# EAGLE design noiseometer_v1 (EAGLE 7.5.0)
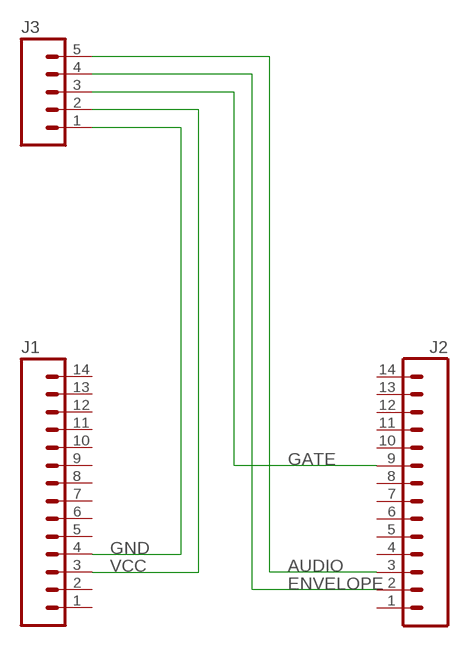
[diagram p0: schematic, sheet 1]

## Parts
J1  M14  [1X14]
J2  M14  [1X14]
J3  M05PTH  [1X05]

## Nets
AUDIO: J2.3 J3.5
ENVELOPE: J2.2 J3.4
GATE: J2.9 J3.3
GND: J1.4 J3.1
VCC: J1.3 J3.2
Unconnected: J1.1 J1.2 J1.5 J1.6 J1.7 J1.8 J1.9 J1.10 J1.11 J1.12 J1.13 J1.14 J2.1 J2.4 J2.5 J2.6 J2.7 J2.8 J2.10 J2.11 J2.12 J2.13 J2.14

## Library data of the parts
J1 J2 = SparkFun-Connectors:M14: Header 14 Standard 14-pin 0.1" header. Use with straight break away headers (SKU : PRT-00116), right angle break away headers (PRT-00553), swiss pins (PRT-00743), machine pins (PRT-00117), and female headers (PRT-00115).
J3 = SparkFun-Connectors:M05: Header 5 Standard 5-pin 0.1" header. Use with straight break away headers (SKU : PRT-00116), right angle break away headers (PRT-00553), swiss pins (PRT-00743), machine pins (PRT-00117), and female headers (PRT-00115). Molex polarized connector foot print use with SKU : PRT-08230 with associated crimp pins and housings.

## Board
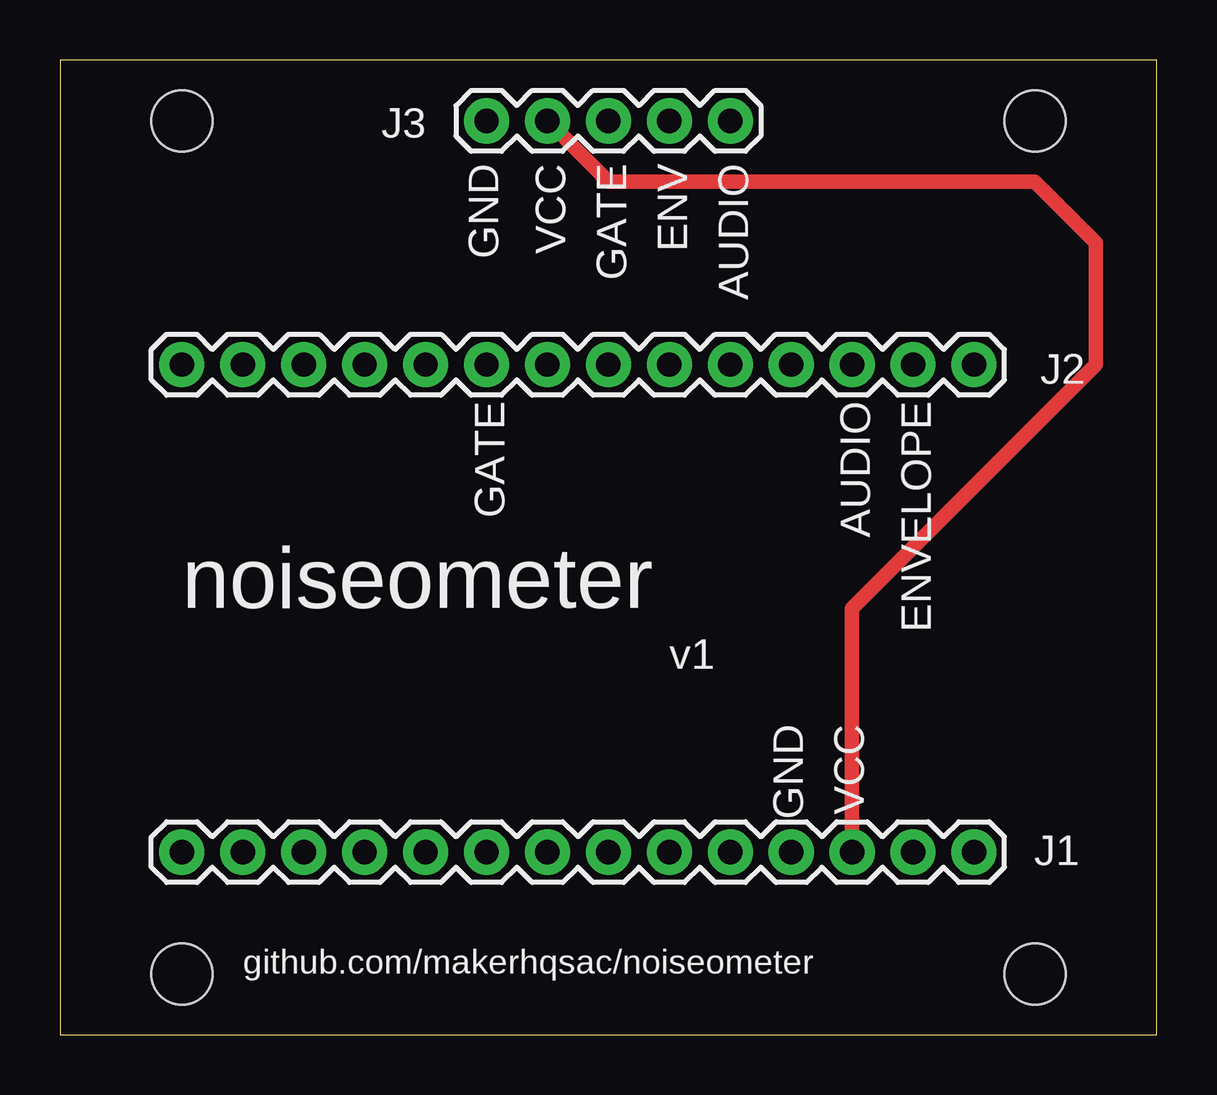
[diagram p1: board, top side]
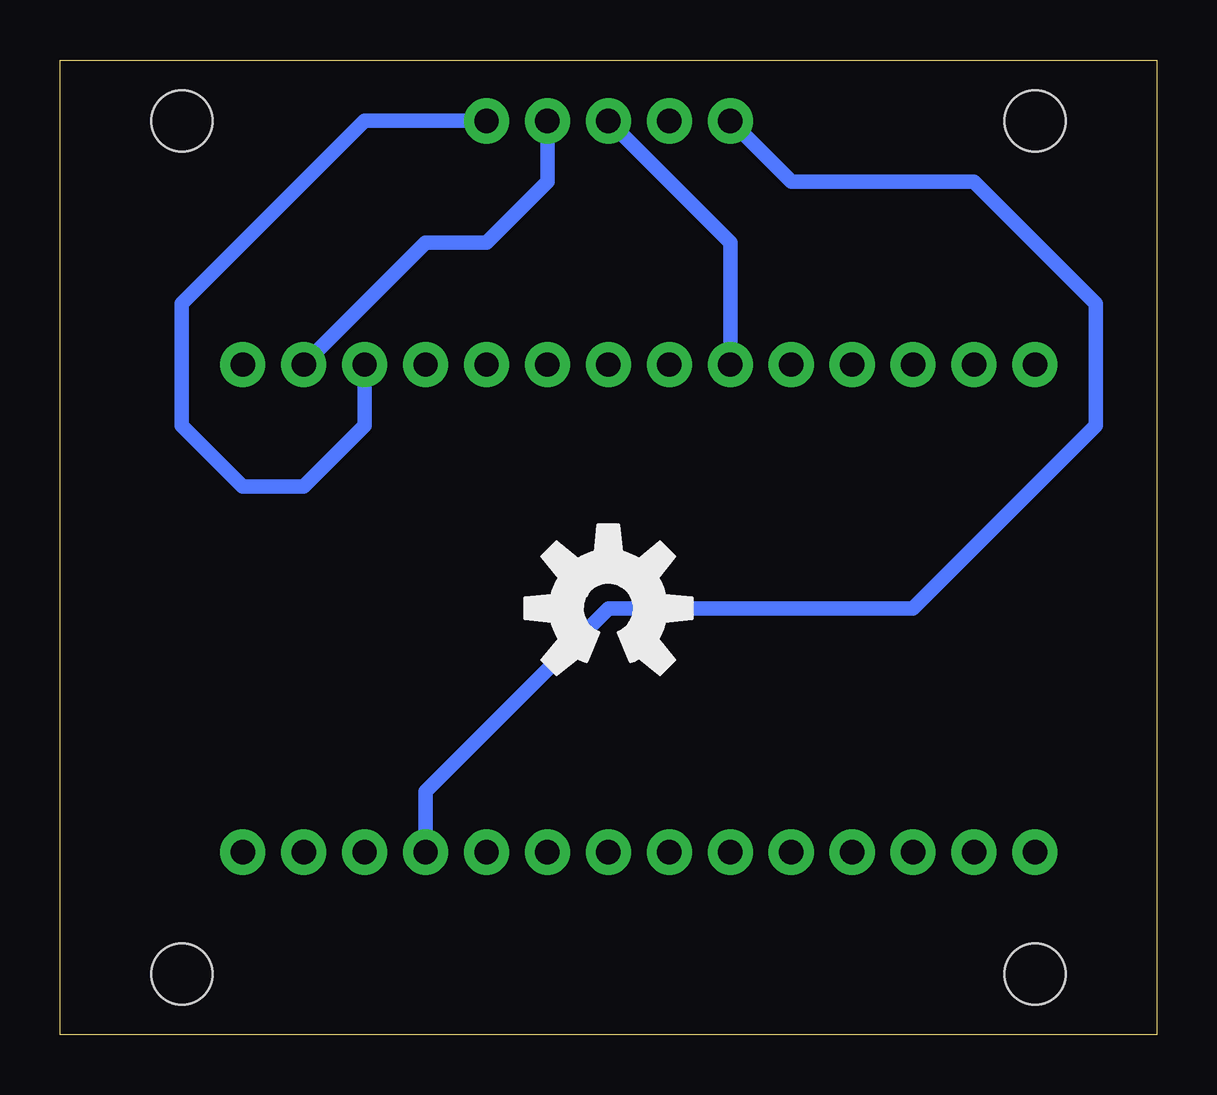
[diagram p2: board, bottom side, seen from below]

Size 45.72 x 40.64 mm. Coordinates in mm from the lower left corner, seen from the top.
Outline: 0,0 45.72,0 45.72,40.64 0,40.64 0,0
Copper layers (1*16): Top 0.035mm / dielectric 1.5mm / Bottom 0.035mm
Design rules "default": minimum track width 10mil, minimum drill 24mil, track to track 8mil, track to pad 8mil, pad to pad 8mil, via to via 8mil, smd to smd 8mil, copper to edge 40mil, drill to drill 8mil, minimum pad ring 10mil, minimum via ring 8mil, stop-mask expansion 4mil, vias tented up to drill 0mil, thermal gap 10mil
Holes 2.54 mm at 5.08,38.1 40.64,38.1 5.08,2.54 40.64,2.54

### Footprints (pad centres in the part's own frame; a part is rotated, then mirrored left to right if it is on the bottom)
1X14 = drill 1.016 pad 1.88: 1 0,0; 2 2.54,0; 3 5.08,0; 4 7.62,0; 5 10.16,0; 6 12.7,0; 7 15.24,0; 8 17.78,0; 9 20.32,0; 10 22.86,0; 11 25.4,0; 12 27.94,0; 13 30.48,0; 14 33.02,0
1X05 = drill 1.016 pad 1.88: 1 0,0; 2 2.54,0; 3 5.08,0; 4 7.62,0; 5 10.16,0

### Placement (x,y rotation side)
J1  38.1,7.62 180 top
J2  38.1,27.94 180 top
J3  17.78,38.1 0 top
U$1  [OSHW-LOGO-L]  22.86,17.78 0 bottom

### Tracks (layer width: path | path; a pad name or v marks a point on that pad's centre or on a via)
AUDIO
  Bottom 0.61: J3.5 33.02,38.1 40.64,30.48 40.64,25.4 38.1,22.86 35.56,22.86 33.02,25.4 J2.3
ENVELOPE
  Bottom 0.61: J3.4 25.4,35.56 27.94,33.02 30.48,33.02 J2.2
GATE
  Bottom 0.61: J2.9 17.78,33.02 J3.3
GND
  Bottom 0.61: J1.4 30.48,10.16 22.86,17.78 10.16,17.78 2.54,25.4 2.54,30.48 7.62,35.56 15.24,35.56 J3.1
VCC
  Top 0.61: J1.3 33.02,17.78 43.18,27.94 43.18,33.02 40.64,35.56 22.86,35.56 J3.2

### Text on the board
tPlace: GND | VCC | GATE | ENV | AUDIO | GATE | AUDIO | ENVELOPE | noiseometer | v1 | GND | VCC | github.com/makerhqsac/noiseometer